# EAGLE schematic MIDI Output (EAGLE 9.3.0)
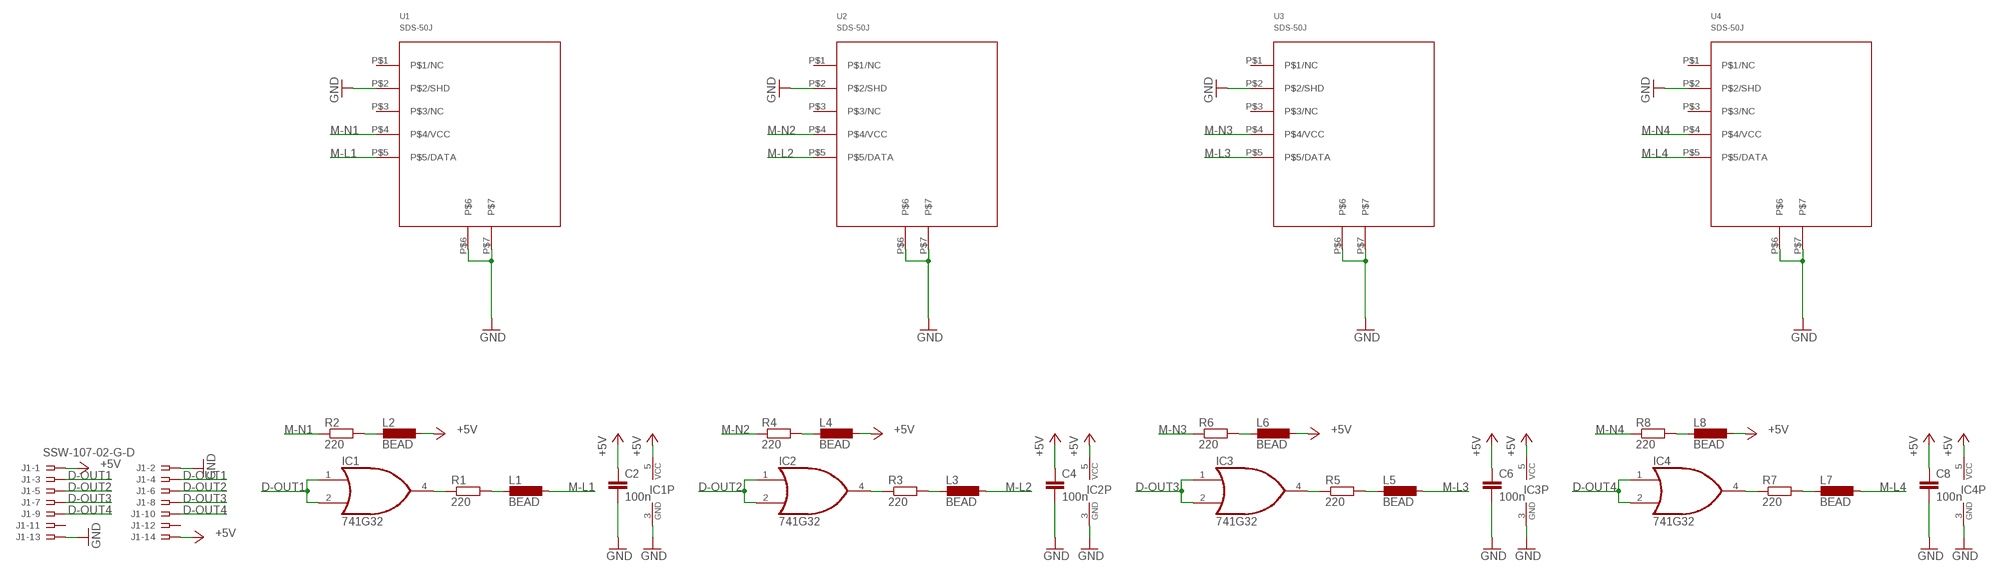
[diagram p0: schematic, sheet 1]

## Parts
C2  100n  C-EUC0805  [C0805]
C4  100n  C-EUC0805  [C0805]
C6  100n  C-EUC0805  [C0805]
C8  100n  C-EUC0805  [C0805]
IC1  741G32  [SOT25]
IC2  741G32  [SOT25]
IC3  741G32  [SOT25]
IC4  741G32  [SOT25]
J1  SSW-107-02-G-D  [SSW-107-02-G-D]
L1  BEAD  [L0805]
L2  BEAD  [L0805]
L3  BEAD  [L0805]
L4  BEAD  [L0805]
L5  BEAD  [L0805]
L6  BEAD  [L0805]
L7  BEAD  [L0805]
L8  BEAD  [L0805]
R1  220  R-EU_R0805  [R0805]
R2  220  R-EU_R0805  [R0805]
R3  220  R-EU_R0805  [R0805]
R4  220  R-EU_R0805  [R0805]
R5  220  R-EU_R0805  [R0805]
R6  220  R-EU_R0805  [R0805]
R7  220  R-EU_R0805  [R0805]
R8  220  R-EU_R0805  [R0805]
U1  SDS-50J  [SDS-50J]
U2  SDS-50J  [SDS-50J]
U3  SDS-50J  [SDS-50J]
U4  SDS-50J  [SDS-50J]

## Nets
+5V: C2.1 C4.1 C6.1 C8.1 IC1.5(VCC) IC2.5(VCC) IC3.5(VCC) IC4.5(VCC) J1.1 J1.14 L2.2 L4.2 L6.2 L8.2
D-OUT1: IC1.1(I0) IC1.2(I1) J1.3 J1.4
D-OUT2: IC2.1(I0) IC2.2(I1) J1.5 J1.6
D-OUT3: IC3.1(I0) IC3.2(I1) J1.7 J1.8
D-OUT4: IC4.1(I0) IC4.2(I1) J1.9 J1.10
GND: C2.2 C4.2 C6.2 C8.2 IC1.3(GND) IC2.3(GND) IC3.3(GND) IC4.3(GND) J1.2 J1.13 U1.P$2(P$2/SHD) U1.P$6 U1.P$7 U2.P$2(P$2/SHD) U2.P$6 U2.P$7 U3.P$2(P$2/SHD) U3.P$6 U3.P$7 U4.P$2(P$2/SHD) U4.P$6 U4.P$7
M-L1: L1.2 U1.P$5(P$5/DATA)
M-L2: L3.2 U2.P$5(P$5/DATA)
M-L3: L5.2 U3.P$5(P$5/DATA)
M-L4: L7.2 U4.P$5(P$5/DATA)
M-N1: R2.1 U1.P$4(P$4/VCC)
M-N2: R4.1 U2.P$4(P$4/VCC)
M-N3: R6.1 U3.P$4(P$4/VCC)
M-N4: R8.1 U4.P$4(P$4/VCC)
N$4: IC1.4(O) R1.1
N$8: L2.1 R2.2
N$9: L1.1 R1.2
N$12: L3.1 R3.2
N$14: L4.1 R4.2
N$16: IC2.4(O) R3.1
N$20: L5.1 R5.2
N$22: L6.1 R6.2
N$24: IC3.4(O) R5.1
N$28: L7.1 R7.2
N$30: L8.1 R8.2
N$32: IC4.4(O) R7.1
Unconnected: J1.11 J1.12 U1.P$1(P$1/NC) U1.P$3(P$3/NC) U2.P$1(P$1/NC) U2.P$3(P$3/NC) U3.P$1(P$1/NC) U3.P$3(P$3/NC) U4.P$1(P$1/NC) U4.P$3(P$3/NC)

## Library data of the parts
C2 C4 C6 C8 = rcl:C-EU: CAPACITOR, European symbol; SPICEPREFIX: C
IC1-IC4 = MIDI router parts:74*1G32: 2-input OR gate; SPICEPREFIX: J
J1 = MIDI router parts:SSW-107-02-G: THROUGH-HOLE .025" SQ POST SOCKET Source: Samtec SSW.pdf; MF: Samtec Inc.; MPN: SSW-107-02-G-D; OC_FARNELL: unknown; OC_NEWARK: 11P9431
L1-L8 = MIDI router parts:BEAD
R1-R8 = rcl:R-EU_: RESISTOR, European symbol; SPICEPREFIX: R
U1-U4 = MIDI router parts:SDS-50J